# EAGLE design 4 digit seven segment  (EAGLE 6.1)
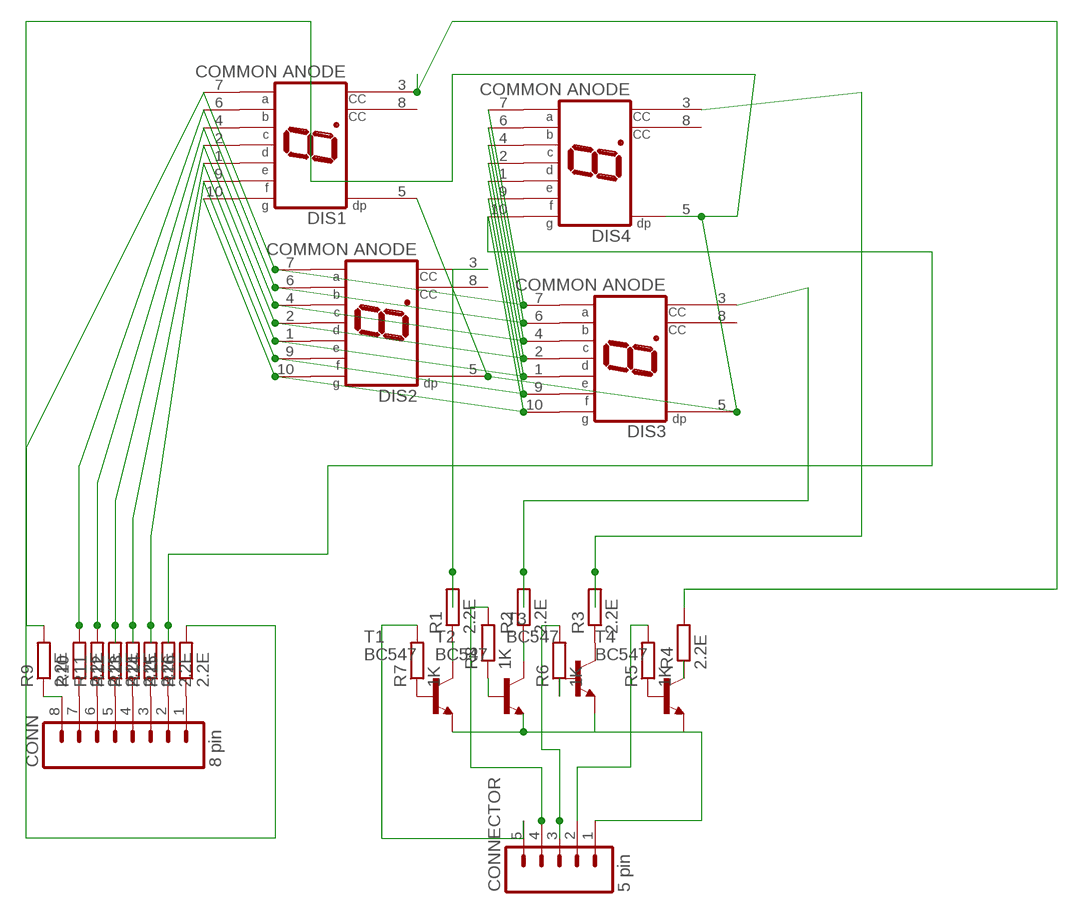
[diagram p0: schematic, sheet 1]

## Parts
CONN  8 pin  M08  [08P]
CONNECTOR  5 pin  M05  [05P]
DIS1  COMMON ANODE  HD-H103  [HDSP-M]
DIS2  COMMON ANODE  HD-H103  [HDSP-M]
DIS3  COMMON ANODE  HD-H103  [HDSP-M]
DIS4  COMMON ANODE  HD-H103  [HDSP-M]
R1  2.2E  R-EU_0204/7  [0204/7]
R2  2.2E  R-EU_0204/7  [0204/7]
R3  2.2E  R-EU_0204/7  [0204/7]
R4  2.2E  R-EU_0204/7  [0204/7]
R5  1K  R-EU_0204/7  [0204/7]
R6  1K  R-EU_0204/7  [0204/7]
R7  1K  R-EU_0204/7  [0204/7]
R8  1K  R-EU_0204/7  [0204/7]
R9  2.2E  R-EU_0204/7  [0204/7]
R10  2.2E  R-EU_0204/7  [0204/7]
R11  2.2E  R-EU_0204/7  [0204/7]
R12  2.2E  R-EU_0204/7  [0204/7]
R13  2.2E  R-EU_0204/7  [0204/7]
R14  2.2E  R-EU_0204/7  [0204/7]
R15  2.2E  R-EU_0204/7  [0204/7]
R16  2.2E  R-EU_0204/7  [0204/7]
T1  BC547  [TO92]
T2  BC547  [TO92]
T3  BC547  [TO92]
T4  BC547  [TO92]

## Nets
N$1: CONNECTOR.4 R8.2
N$2: DIS1.9(F) DIS2.9(F) DIS3.9(F) DIS4.9(F) R14.2
N$3: DIS1.2(D) DIS2.2(D) DIS3.2(D) DIS4.2(D) R12.2
N$4: DIS1.6(B) DIS2.6(B) DIS3.6(B) DIS4.6(B) R10.2
N$5: DIS1.7(A) DIS2.7(A) DIS3.7(A) DIS4.7(A) R9.2
N$6: DIS3.3(CC) R2.2
N$7: DIS1.4(C) DIS2.4(C) DIS3.4(C) DIS4.4(C) R11.2
N$8: DIS1.1(E) DIS2.1(E) DIS3.1(E) DIS4.1(E) R13.2
N$9: CONNECTOR.3 R6.2
N$10: DIS3.8(CC)
N$11: R1.1 T1.3(C)
N$12: R2.1 T2.3(C)
N$13: R3.1 T3.3(C)
N$14: R4.1 T4.3(C)
N$15: R5.1 T4.2(B)
N$16: R6.1 T3.2(B)
N$17: R7.1 T1.2(B)
N$18: R8.1 T2.2(B)
N$19: CONN.8 R9.1
N$20: CONN.7 R10.1
N$21: CONN.6 R11.1
N$22: CONN.4 R13.1
N$23: CONN.3 R14.1
N$24: CONN.2 R15.1
N$25: CONN.1 R16.1
N$26: CONN.5 R12.1
N$27: DIS1.10(G) DIS2.10(G) DIS3.10(G) DIS4.10(G) R15.2
N$28: DIS1.5(DP) DIS2.5(DP) DIS3.5(DP) DIS4.5(DP) R16.2
N$29: CONNECTOR.5 R7.2
N$30: CONNECTOR.2 R5.2
N$31: CONNECTOR.1 T1.1(E) T2.1(E) T3.1(E) T4.1(E)
N$32: DIS1.3(CC) R4.2
N$33: DIS4.3(CC) R3.2
N$34: DIS2.3(CC) R1.2
Unconnected: DIS1.8(CC) DIS2.8(CC) DIS4.8(CC)

## Library data of the parts
CONN = con-amp-quick:M08: AMP QUICK CONNECTOR; OC_FARNELL: unknown; OC_NEWARK: unknown
CONNECTOR = con-amp-quick:M05: AMP QUICK CONNECTOR; OC_FARNELL: unknown; OC_NEWARK: unknown
DIS1-DIS4 = display-hp:HD-H103: LED DISPLAY 1-character 7 segment, decimal point right; OC_FARNELL: unknown; OC_NEWARK: unknown
R1-R16 = rcl:R-EU_: RESISTOR, European symbol
T1-T4 = transistor:BC547: NPN TRANSISTOR

## Board
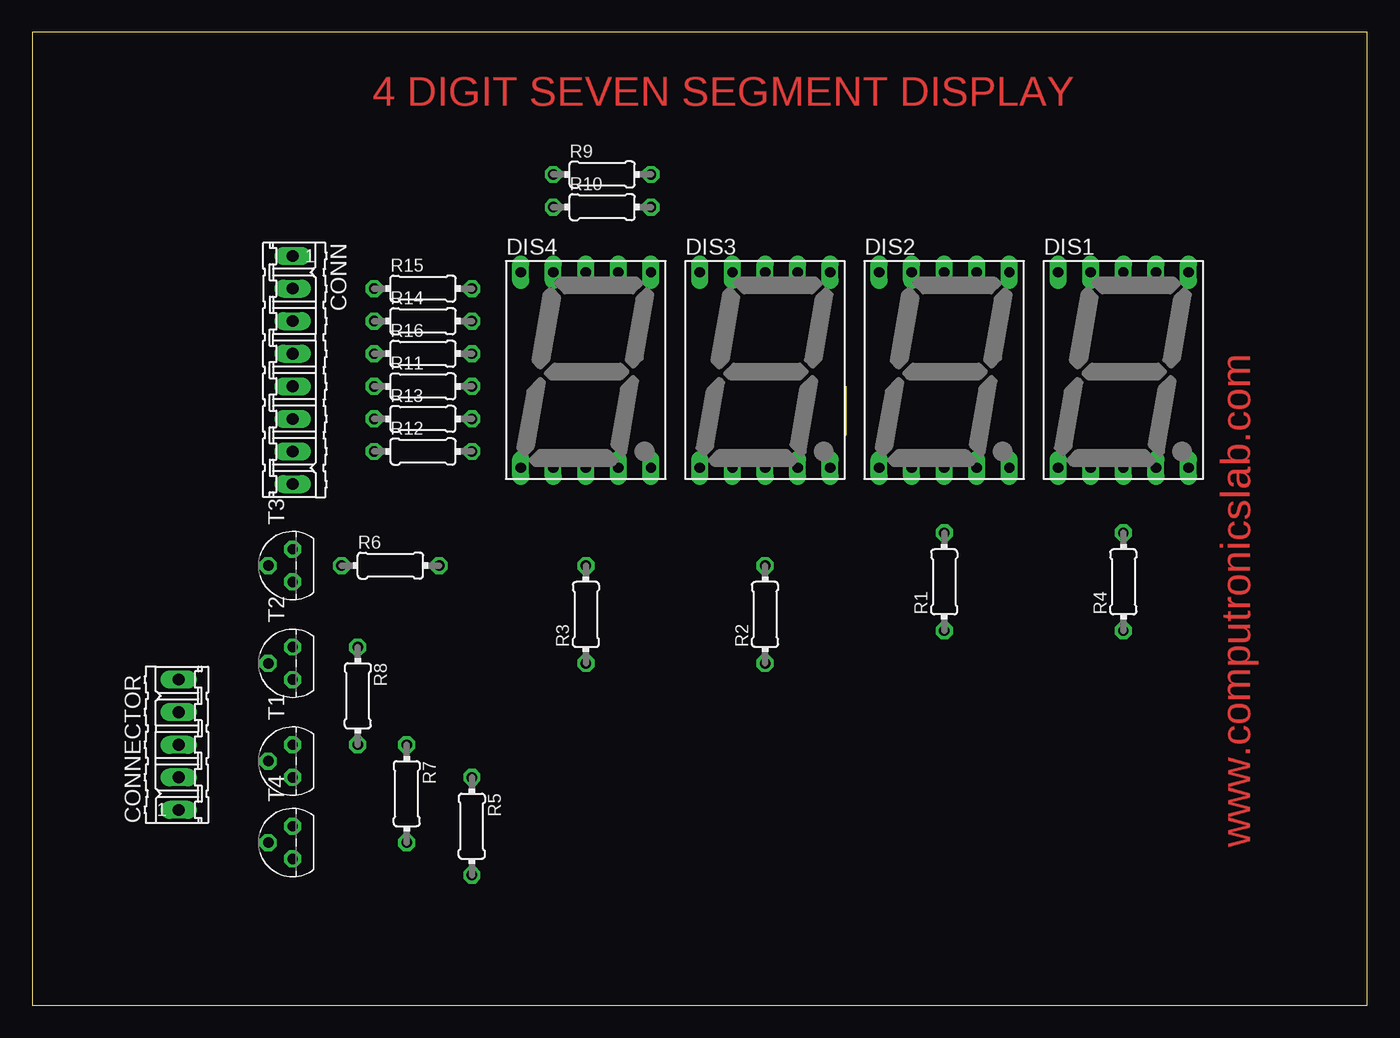
[diagram p1: board, top side]
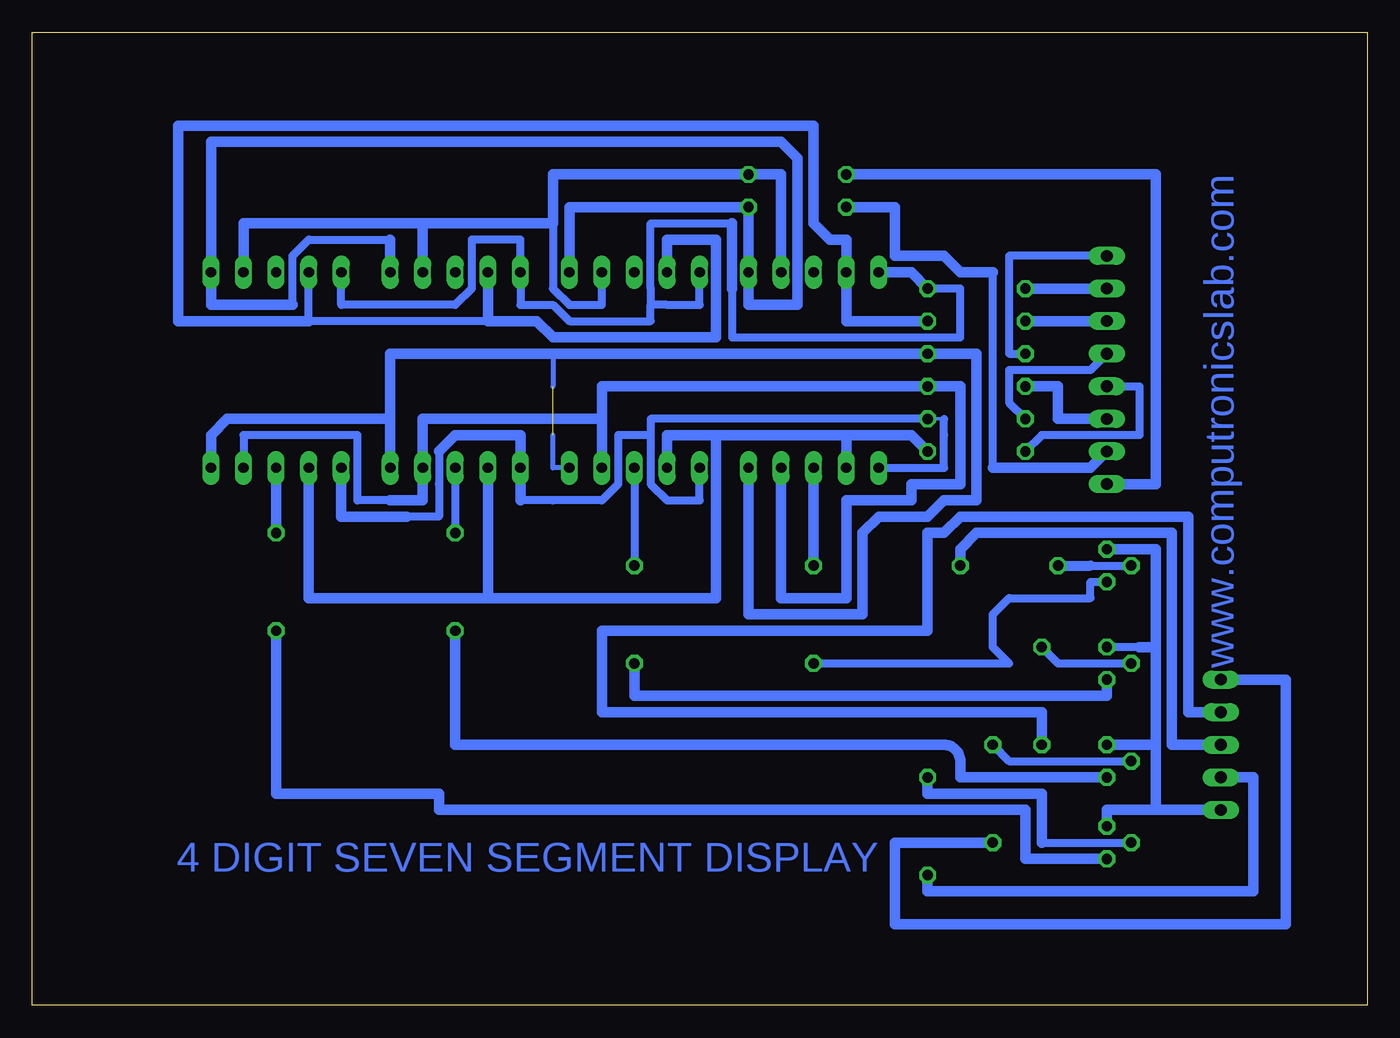
[diagram p2: board, bottom side, seen from below]

Size 104.12 x 75.87 mm. Coordinates in mm from the lower left corner, seen from the top.
Outline: 0,0 104.12,0 104.12,75.87 0,75.87 0,0
Copper layers (1*16): Top 0.035mm / dielectric 1.5mm / Bottom 0.035mm
Design rules: minimum track width 10mil, minimum drill 24mil, track to track 8mil, track to pad 8mil, pad to pad 8mil, via to via 8mil, smd to smd 8mil, copper to edge 40mil, drill to drill 8mil, minimum pad ring 10mil, minimum via ring 8mil, stop-mask expansion 4mil, vias tented up to drill 0mil, thermal gap 10mil

### Footprints (pad centres in the part's own frame; a part is rotated, then mirrored left to right if it is on the bottom)
08P = drill 0.914 long: 1 -8.89,0; 2 -6.35,0; 3 -3.81,0; 4 -1.27,0; 5 1.27,0; 6 3.81,0; 7 6.35,0; 8 8.89,0
05P = drill 0.914 long: 1 -5.08,0; 2 -2.54,0; 3 0,0; 4 2.54,0; 5 5.08,0
HDSP-M = drill 0.813 long: 1 -5.08,-7.62; 2 -2.54,-7.62; 3 0,-7.62; 4 2.54,-7.62; 5 5.08,-7.62; 6 5.08,7.62; 7 2.54,7.62; 8 0,7.62; 9 -2.54,7.62; 10 -5.08,7.62
0204/7 = drill 0.813 octagon: 1 -3.81,0; 2 3.81,0
TO92 = drill 0.813 octagon: 1 1.27,0; 2 0,1.905; 3 -1.27,0

### Placement (x,y rotation side)
CONN  20.32,49.53 270 top
CONNECTOR  11.43,20.32 90 top
DIS1  85.09,49.53 0 top
DIS2  71.12,49.53 0 top
DIS3  57.15,49.53 0 top
DIS4  43.18,49.53 0 top
R1  71.12,33.02 90 top
R2  57.15,30.48 90 top
R3  43.18,30.48 90 top
R4  85.09,33.02 90 top
R5  34.29,13.97 270 top
R6  27.94,34.29 0 top
R7  29.21,16.51 270 top
R8  25.4,24.13 270 top
R9  44.45,64.77 0 top
R10  44.45,62.23 0 top
R11  30.48,48.26 0 top
R12  30.48,43.18 0 top
R13  30.48,45.72 0 top
R14  30.48,53.34 0 top
R15  30.48,55.88 0 top
R16  30.48,50.8 0 top
T1  20.32,19.05 90 top
T2  20.32,26.67 90 top
T3  20.32,34.29 90 top
T4  20.32,12.7 90 top

### Tracks (layer width: path | path; a pad name or v marks a point on that pad's centre or on a via)
N$1
  Bottom 0.813: R8.2 25.4,22.86 59.69,22.86 59.69,29.21 34.29,29.21 34.29,36.83 33.02,36.83 31.75,38.1 13.97,38.1 13.97,22.86 CONNECTOR.4
N$2
  Bottom 0.61: DIS1.9 82.55,53.34 68.58,53.34
  Bottom 0.813: R14.2 40.64,53.34 DIS4.9 40.64,59.69 41.91,59.69 43.18,60.96 43.18,68.58 92.71,68.58 92.71,53.34 82.55,53.34 | DIS3.9 54.61,59.69 50.8,59.69 50.8,52.07 63.5,52.07 64.77,53.34 68.58,53.34 DIS2.9
N$3
  Bottom 0.813: DIS2.2 68.58,35.56 68.58,31.75 | DIS1.2 82.55,31.75 68.58,31.75 | 40.64,44.45 DIS4.2 | 40.64,44.45 35.56,44.45 R12.2 | 50.8,44.45 54.61,44.45 DIS3.2 | 40.64,44.45 50.8,44.45 | 68.58,31.75 50.8,31.75 50.8,44.45
N$4
  Bottom 0.61: 76.2,59.69 82.55,59.69 83.82,58.42 83.82,54.61
  Bottom 0.813: 76.2,59.69 DIS2.6 | 83.82,54.61 90.17,54.61 DIS1.6 90.17,66.04 90.17,67.31 81.28,67.31 45.72,67.31 44.45,66.04 44.45,54.61 48.26,54.61 DIS4.6 R10.2 62.23,62.23 DIS3.6
N$5
  Bottom 0.254: 69.85,60.96 73.66,60.96
  Bottom 0.61: DIS3.7 59.69,54.61 62.23,54.61 63.5,55.88 63.5,60.96
  Bottom 0.813: DIS4.7 45.72,64.77 R9.2 63.5,64.77 63.5,60.96 69.85,60.96 83.82,60.96 87.63,60.96 DIS1.7 | 73.66,60.96 DIS2.7
N$6
  Bottom 0.61: DIS3.3 R2.2
N$7
  Bottom 0.61: DIS1.4 87.63,44.45 78.74,44.45 78.74,39.37 76.2,39.37
  Bottom 0.813: DIS4.4 45.72,31.75 40.64,31.75 40.64,39.37 35.56,39.37 35.56,40.64 33.02,40.64 31.75,40.64 31.75,41.91 31.75,48.26 R11.2 59.69,48.26 59.69,45.72 | 59.69,45.72 DIS3.4 | 59.69,45.72 73.66,45.72 DIS2.4 73.66,39.37 76.2,39.37
N$8
  Bottom 0.254: 33.02,45.72 R13.2
  Bottom 0.61: 33.02,45.72 33.02,44.45 33.02,41.91 DIS4.1 | DIS3.1 52.07,39.37 54.61,39.37 55.88,40.64 55.88,44.45 | 55.88,44.45 55.88,45.72 R13.2 | 66.04,39.37 63.5,39.37 59.69,39.37 58.42,40.64 58.42,44.45 55.88,44.45 | 74.93,38.1 72.39,38.1 72.39,40.64 72.39,43.18
  Bottom 0.813: 66.04,39.37 DIS2.1 66.04,44.45 68.58,44.45 71.12,44.45 72.39,43.18 | DIS1.1 80.01,38.1 76.2,38.1 74.93,38.1
N$9
  Bottom 0.813: R6.2 31.75,35.56 30.48,36.83 15.24,36.83 15.24,20.32 CONNECTOR.3
N$11
  Bottom 0.813: T1.3 30.48,17.78 31.75,17.78 31.75,19.05 arc-90 33.02,20.32 71.12,20.32 R1.1
N$12
  Bottom 0.813: T2.3 20.32,24.13 57.15,24.13 R2.1
N$13
  Bottom 0.61: T3.3 21.59,33.02 21.59,31.75 27.94,31.75 29.21,30.48 29.21,27.94 27.94,26.67 R3.1
N$14
  Bottom 0.813: T4.3 26.67,11.43 26.67,15.24 29.21,15.24 33.02,15.24 72.39,15.24 72.39,16.51 85.09,16.51 R4.1
N$15
  Bottom 0.61: 25.4,12.7 T4.2
  Bottom 0.813: R5.1 34.29,16.51 30.48,16.51 25.4,16.51 25.4,12.7
N$16
  Bottom 0.61: 21.59,34.29 T3.2
  Bottom 0.762: R6.1 21.59,34.29
N$17
  Bottom 0.61: T1.2 27.94,19.05 R7.1
N$18
  Bottom 0.61: T2.2 24.13,26.67 R8.1
N$19
  Bottom 0.813: R9.1 16.51,64.77 16.51,40.64 CONN.8
N$20
  Bottom 0.61: 29.21,41.91 29.21,57.15
  Bottom 0.813: R10.1 36.83,62.23 36.83,58.42 33.02,58.42 31.75,57.15 29.21,57.15 | 29.21,41.91 21.59,41.91 CONN.7
N$21
  Bottom 0.813: R11.1 24.13,48.26 24.13,45.72 CONN.6
N$22
  Bottom 0.61: R13.1 27.94,46.99 27.94,49.53 21.59,49.53 CONN.4
N$23
  Bottom 0.813: CONN.3 R14.1
N$24
  Bottom 0.813: CONN.2 R15.1
N$25
  Bottom 0.61: R16.1 27.94,50.8 27.94,58.42 CONN.1
N$26
  Bottom 0.61: R12.1 25.4,44.45 19.05,44.45 17.78,44.45 17.78,45.72 17.78,48.26 CONN.5
N$27
  Bottom 0.61: 55.88,54.61 55.88,53.34 62.23,53.34 63.5,54.61 66.04,54.61 DIS2.10 66.04,59.69 69.85,59.69 69.85,55.88 71.12,54.61 80.01,54.61 DIS1.10 | 55.88,54.61 55.88,55.88 55.88,60.96 49.53,60.96 | DIS3.10 52.07,54.61 54.61,54.61 55.88,54.61 | R15.2 31.75,55.88 31.75,54.61 31.75,52.07 49.53,52.07 49.53,55.88
  Bottom 0.813: R15.2 35.56,57.15 DIS4.10 | 49.53,60.96 49.53,55.88
N$28  (1 unrouted)
  Bottom 0.254: 76.2,45.72 DIS2.5
  Bottom 0.406: 67.31,50.8 63.5,50.8 63.5,48.26 | DIS3.5 63.5,41.91 63.5,44.45
  Bottom 0.813: 76.2,45.72 88.9,45.72 90.17,44.45 DIS1.5 | DIS4.5 48.26,30.48 39.37,30.48 39.37,35.56 39.37,36.83 38.1,38.1 34.29,38.1 33.02,39.37 30.48,39.37 30.48,50.8 R16.2 67.31,50.8 76.2,50.8 DIS2.5
N$29
  Bottom 0.813: R7.2 36.83,12.7 36.83,6.35 6.35,6.35 6.35,25.4 CONNECTOR.5
N$30
  Bottom 0.813: R5.2 34.29,8.89 8.89,8.89 8.89,17.78 CONNECTOR.2
N$31
  Bottom 0.254: 12.7,15.24 16.51,15.24 | 16.51,20.32 17.78,20.32 | 16.51,27.94 17.78,27.94
  Bottom 0.61: 17.78,27.94 T2.1
  Bottom 0.813: T4.1 20.32,15.24 19.05,15.24 12.7,15.24 CONNECTOR.1 | T1.1 17.78,20.32 16.51,20.32 | 16.51,15.24 16.51,20.32 | 16.51,27.94 16.51,26.67 16.51,20.32 | T3.1 17.78,35.56 16.51,35.56 16.51,34.29 16.51,27.94 | 17.78,27.94 16.51,27.94
N$32
  Bottom 0.813: DIS1.3 R4.2
N$33
  Bottom 0.813: DIS4.3 R3.2
N$34
  Bottom 0.61: DIS2.3 R1.2

### Text on the board
Top: 4 DIGIT SEVEN SEGMENT DISPLAY | www.computronicslab.com
Bottom: www.computronicslab.com | 4 DIGIT SEVEN SEGMENT DISPLAY